# Altium schematic sheet VmeConnectors.SchDoc: VME P1 & P2
size 594 x 420 mm; CheckedBy: CEGELEC BC; CompanyName: CERN; DrawnBy: Andrea Boccardi; Organization: CERN; Address1: European Organization for Nuclear Research; Address2: CH-1211 Genève 23 - Switzerland; Revision: -; SheetNumber: 3; SheetTotal: 11; EDA_Number: EDA-xxxx; Projet: Simple VME FMC Carrier; ModifiedBy: -; CreateDate: 30/03/2010; CheckedDate: 06/04/2010; DivGrp: BE-CO; Designer: Andrea Boccardi; PageSetup: Record=PageOptions|CenterHorizontal=True|CenterVertical=True|PrintScale=0.67|XCorrection=1.00|YCorrection=1.00|PrintKind=1|BorderSize=5000000|LeftOffset=0|BottomOffset=0|Orientation=2|PaperLength=1000|PaperWidth=1000|Scale=100|PaperSource=15|PrintQuality=600|MediaType=1|DitherType=10|PaperKind=A3|PrintScaleMode=1; ModifiedDate: -
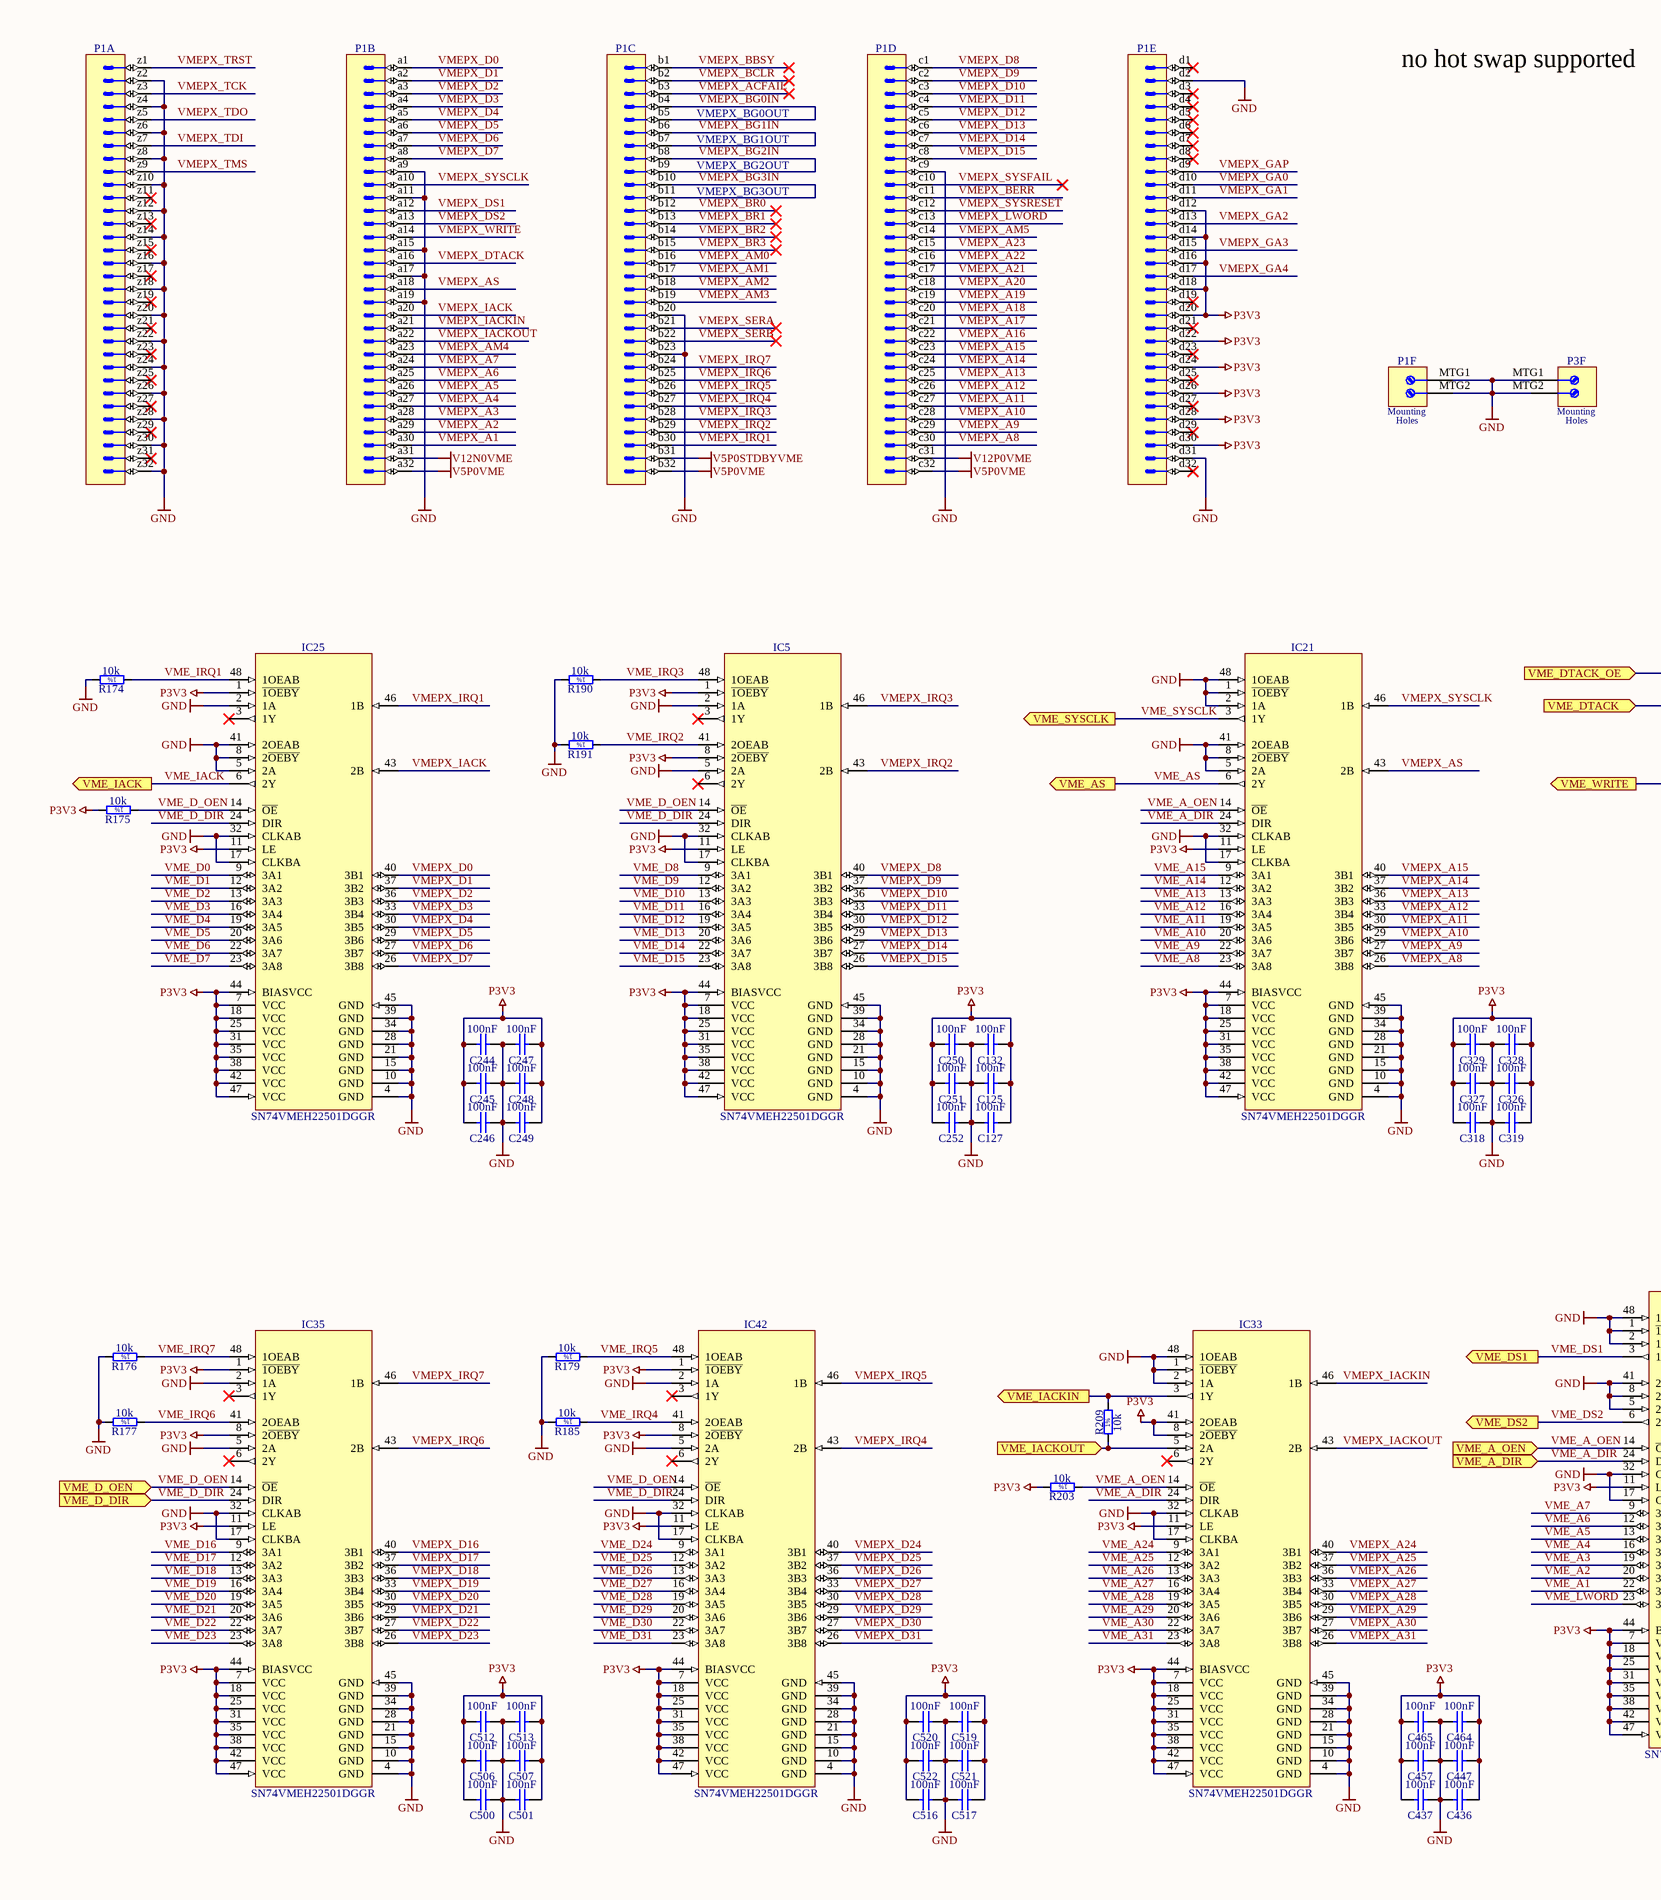
[diagram p0: VmeConnectors.SchDoc, left]
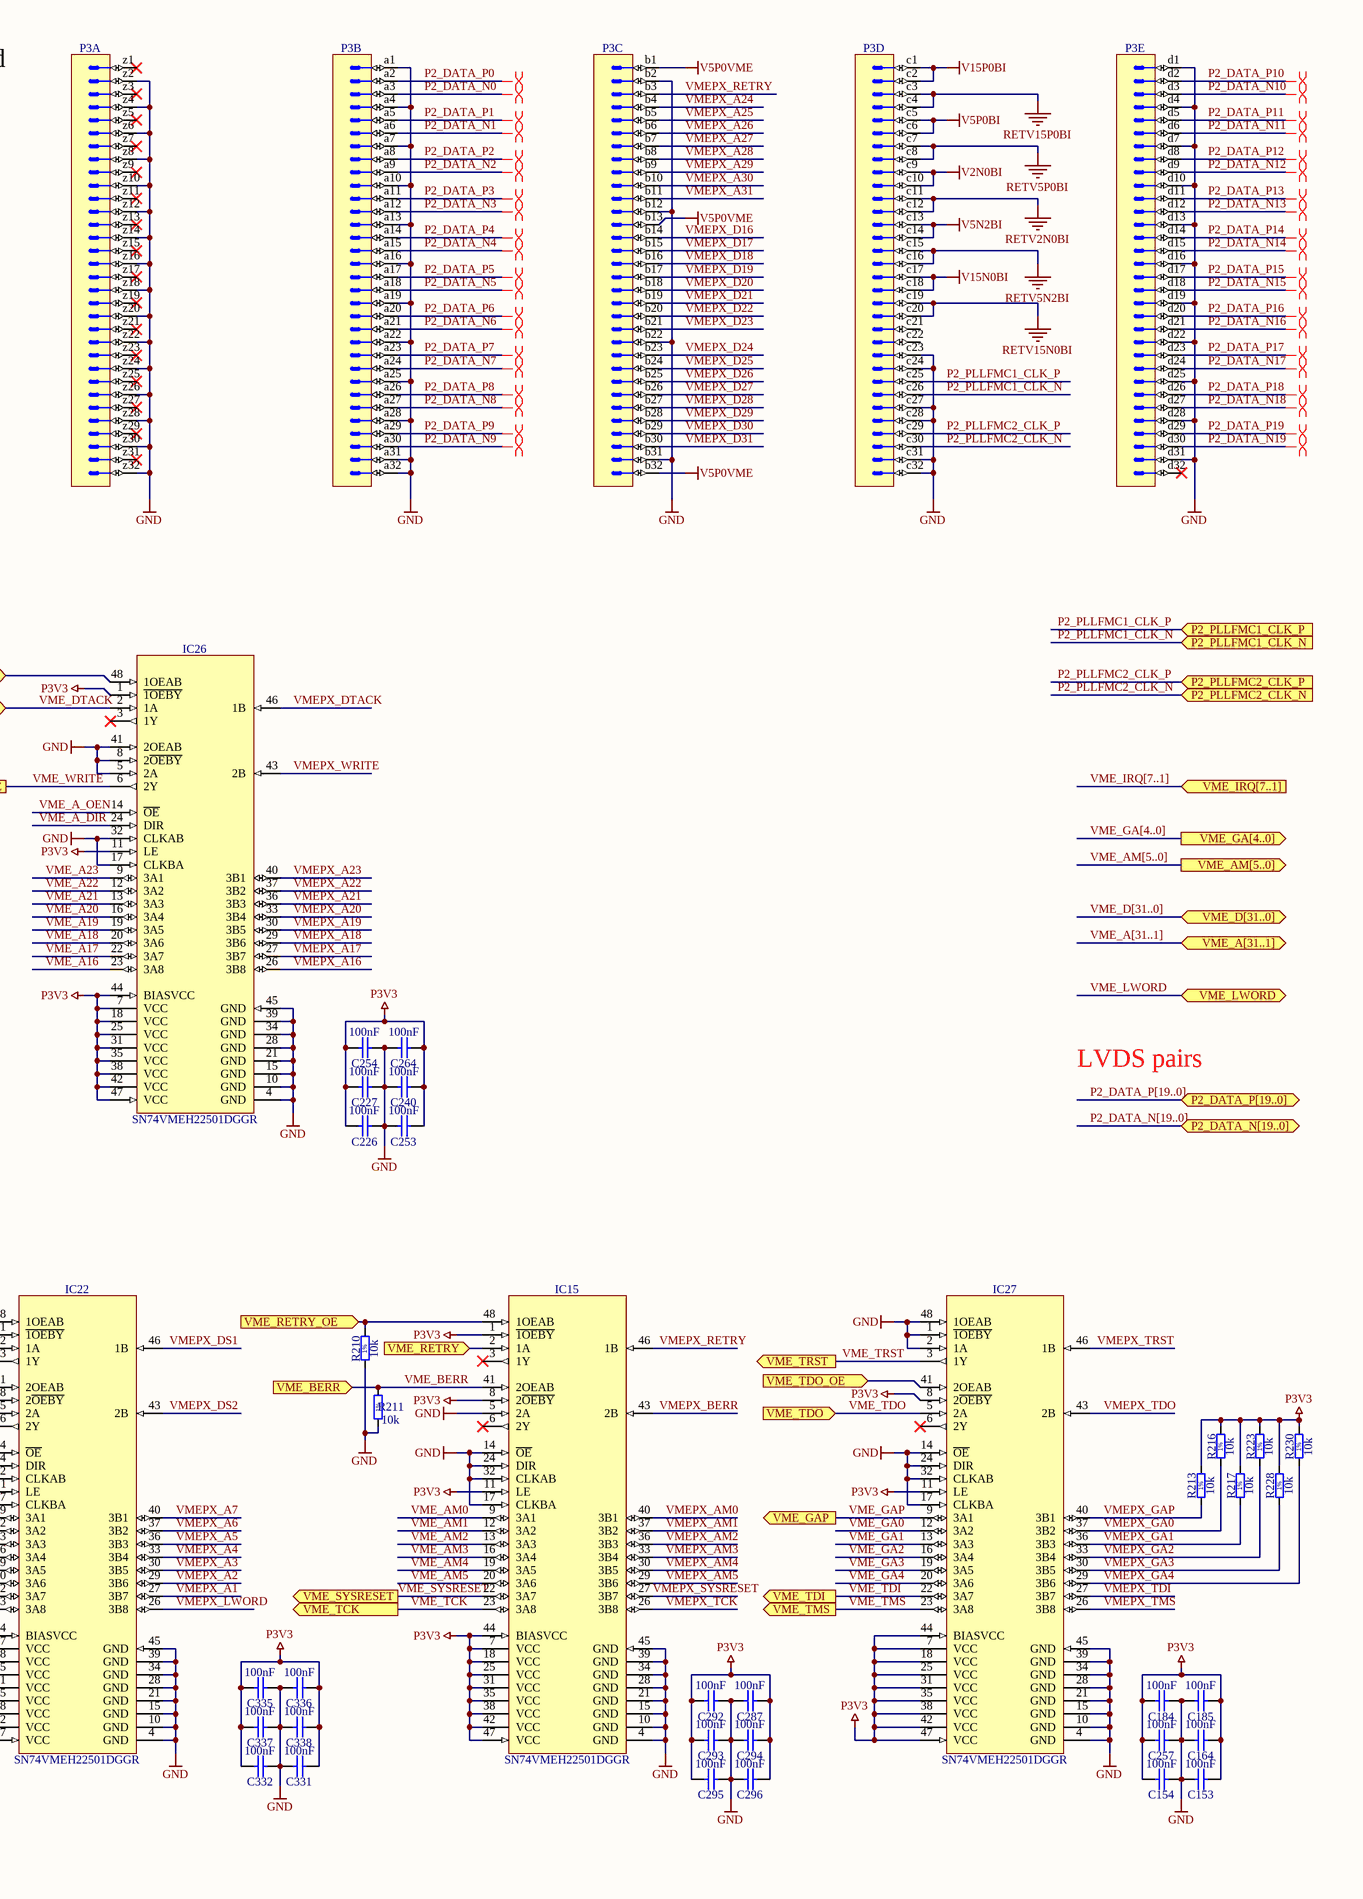
[diagram p1: VmeConnectors.SchDoc, right]

## Parts
C125  100nF  [CAPC1005X55N]
C127  100nF  [CAPC1005X55N]
C132  100nF  [CAPC1005X55N]
C153  100nF  [CAPC1005X55N]
C154  100nF  [CAPC1005X55N]
C164  100nF  [CAPC1005X55N]
C184  100nF  [CAPC1005X55N]
C185  100nF  [CAPC1005X55N]
C226  100nF  [CAPC1005X55N]
C227  100nF  [CAPC1005X55N]
C240  100nF  [CAPC1005X55N]
C244  100nF  [CAPC1005X55N]
C245  100nF  [CAPC1005X55N]
C246  100nF  [CAPC1005X55N]
C247  100nF  [CAPC1005X55N]
C248  100nF  [CAPC1005X55N]
C249  100nF  [CAPC1005X55N]
C250  100nF  [CAPC1005X55N]
C251  100nF  [CAPC1005X55N]
C252  100nF  [CAPC1005X55N]
C253  100nF  [CAPC1005X55N]
C254  100nF  [CAPC1005X55N]
C257  100nF  [CAPC1005X55N]
C264  100nF  [CAPC1005X55N]
C287  100nF  [CAPC1005X55N]
C292  100nF  [CAPC1005X55N]
C293  100nF  [CAPC1005X55N]
C294  100nF  [CAPC1005X55N]
C295  100nF  [CAPC1005X55N]
C296  100nF  [CAPC1005X55N]
C318  100nF  [CAPC1005X55N]
C319  100nF  [CAPC1005X55N]
C326  100nF  [CAPC1005X55N]
C327  100nF  [CAPC1005X55N]
C328  100nF  [CAPC1005X55N]
C329  100nF  [CAPC1005X55N]
C331  100nF  [CAPC1005X55N]
C332  100nF  [CAPC1005X55N]
C335  100nF  [CAPC1005X55N]
C336  100nF  [CAPC1005X55N]
C337  100nF  [CAPC1005X55N]
C338  100nF  [CAPC1005X55N]
C436  100nF  [CAPC1005X55N]
C437  100nF  [CAPC1005X55N]
C447  100nF  [CAPC1005X55N]
C457  100nF  [CAPC1005X55N]
C464  100nF  [CAPC1005X55N]
C465  100nF  [CAPC1005X55N]
C500  100nF  [CAPC1005X55N]
C501  100nF  [CAPC1005X55N]
C506  100nF  [CAPC1005X55N]
C507  100nF  [CAPC1005X55N]
C512  100nF  [CAPC1005X55N]
C513  100nF  [CAPC1005X55N]
C516  100nF  [CAPC1005X55N]
C517  100nF  [CAPC1005X55N]
C519  100nF  [CAPC1005X55N]
C520  100nF  [CAPC1005X55N]
C521  100nF  [CAPC1005X55N]
C522  100nF  [CAPC1005X55N]
IC5  SN74VMEH22501DGGR  [SOP50P810X120-48N]
IC15  SN74VMEH22501DGGR  [SOP50P810X120-48N]
IC21  SN74VMEH22501DGGR  [SOP50P810X120-48N]
IC22  SN74VMEH22501DGGR  [SOP50P810X120-48N]
IC25  SN74VMEH22501DGGR  [SOP50P810X120-48N]
IC26  SN74VMEH22501DGGR  [SOP50P810X120-48N]
IC27  SN74VMEH22501DGGR  [SOP50P810X120-48N]
IC33  SN74VMEH22501DGGR  [SOP50P810X120-48N]
IC35  SN74VMEH22501DGGR  [SOP50P810X120-48N]
IC42  SN74VMEH22501DGGR  [SOP50P810X120-48N]
P1  HAR-BUS 64  [HARTING_02 01 160 2101]  (value not drawn)  (parts A,B,C,D,E,F of 6)
P3  HAR-BUS 64  [HARTING_02 01 160 2101]  (value not drawn)  (parts A,B,C,D,E,F of 6)
R174  10k  [RESC1608X55N]
R175  10k  [RESC1608X55N]
R176  10k  [RESC1608X55N]
R177  10k  [RESC1608X55N]
R179  10k  [RESC1608X55N]
R185  10k  [RESC1608X55N]
R190  10k  [RESC1608X55N]
R191  10k  [RESC1608X55N]
R203  10k  [RESC1608X55N]
R209  10k  [RESC1608X55N]
R210  10k  [RESC1608X55N]
R211  10k  [RESC1608X55N]
R213  10k  [RESC1608X55N]
R216  10k  [RESC1608X55N]
R217  10k  [RESC1608X55N]
R223  10k  [RESC1608X55N]
R228  10k  [RESC1608X55N]
R230  10k  [RESC1608X55N]

## Ports
P2_DATA_N[19..0] (bidir), P2_DATA_P[19..0] (bidir), P2_PLLFMC1_CLK_N (in), P2_PLLFMC1_CLK_P (in), P2_PLLFMC2_CLK_N (in), P2_PLLFMC2_CLK_P (in), VME_A[31..1] (bidir), VME_A_DIR (in), VME_A_OEN (in), VME_AM[5..0] (out), VME_AS (out), VME_BERR (in), VME_D[31..0] (bidir), VME_D_DIR (in), VME_D_OEN (in), VME_DS1 (out), VME_DS2 (out), VME_DTACK (in), VME_DTACK_OE (in), VME_GA[4..0] (out), VME_GAP (out), VME_IACK (out), VME_IACKIN (out), VME_IACKOUT (in), VME_IRQ[7..1] (in), VME_LWORD (bidir), VME_RETRY (in), VME_RETRY_OE (in), VME_SYSCLK (out), VME_SYSRESET (out), VME_TCK (out), VME_TDI (out), VME_TDO (in), VME_TDO_OE (in), VME_TMS (out), VME_TRST (out), VME_WRITE (out)

## Nets
GND: C125.2 C127.2 C132.2 C153.2 C154.1 C164.2 C184.1 C185.2 C226.1 C227.1 C240.2 C244.1 C245.1 C246.1 C247.2 C248.2 C249.2 C250.1 C251.1 C252.1 C253.2 C254.1 C257.1 C264.2 C287.2 C292.1 C293.1 C294.2 C295.1 C296.2 C318.1 C319.2 C326.2 C327.1 C328.2 C329.1 C331.2 C332.1 C335.1 C336.2 C337.1 C338.2 C436.2 C437.1 C447.2 C457.1 C464.2 C465.1 C500.1 C501.2 C506.1 C507.2 C512.1 C513.2 C516.1 C517.2 C519.2 C520.1 C521.2 C522.1 IC5.2(1A) IC5.4(GND) IC5.5(2A) IC5.10(GND) IC5.15(GND) IC5.17(CLKBA) IC5.21(GND) IC5.28(GND) IC5.32(CLKAB) IC5.34(GND) IC5.39(GND) IC5.45(GND) IC15.4(GND) IC15.5(2A) IC15.10(GND) IC15.14(~{OE}) IC15.15(GND) IC15.17(CLKBA) IC15.21(GND) IC15.24(DIR) IC15.28(GND) IC15.32(CLKAB) IC15.34(GND) IC15.39(GND) IC15.45(GND) IC21.1(~{1OEBY}) IC21.2(1A) IC21.4(GND) IC21.5(2A) IC21.8(2~{OEBY}) IC21.10(GND) IC21.15(GND) IC21.17(CLKBA) IC21.21(GND) IC21.28(GND) IC21.32(CLKAB) IC21.34(GND) IC21.39(GND) IC21.41(2OEAB) IC21.45(GND) IC21.48(1OEAB) IC22.1(~{1OEBY}) IC22.2(1A) IC22.4(GND) IC22.5(2A) IC22.8(2~{OEBY}) IC22.10(GND) IC22.15(GND) IC22.17(CLKBA) IC22.21(GND) IC22.28(GND) IC22.32(CLKAB) IC22.34(GND) IC22.39(GND) IC22.41(2OEAB) IC22.45(GND) IC22.48(1OEAB) IC25.2(1A) IC25.4(GND) IC25.5(2A) IC25.8(2~{OEBY}) IC25.10(GND) IC25.15(GND) IC25.17(CLKBA) IC25.21(GND) IC25.28(GND) IC25.32(CLKAB) IC25.34(GND) IC25.39(GND) IC25.41(2OEAB) IC25.45(GND) IC26.4(GND) IC26.5(2A) IC26.8(2~{OEBY}) IC26.10(GND) IC26.15(GND) IC26.17(CLKBA) IC26.21(GND) IC26.28(GND) IC26.32(CLKAB) IC26.34(GND) IC26.39(GND) IC26.41(2OEAB) IC26.45(GND) IC27.1(~{1OEBY}) IC27.2(1A) IC27.4(GND) IC27.10(GND) IC27.14(~{OE}) IC27.15(GND) IC27.17(CLKBA) IC27.21(GND) IC27.24(DIR) IC27.28(GND) IC27.32(CLKAB) IC27.34(GND) IC27.39(GND) IC27.45(GND) IC27.48(1OEAB) IC33.1(~{1OEBY}) IC33.2(1A) IC33.4(GND) IC33.10(GND) IC33.15(GND) IC33.17(CLKBA) IC33.21(GND) IC33.28(GND) IC33.32(CLKAB) IC33.34(GND) IC33.39(GND) IC33.45(GND) IC33.48(1OEAB) IC35.2(1A) IC35.4(GND) IC35.5(2A) IC35.10(GND) IC35.15(GND) IC35.17(CLKBA) IC35.21(GND) IC35.28(GND) IC35.32(CLKAB) IC35.34(GND) IC35.39(GND) IC35.45(GND) IC42.2(1A) IC42.4(GND) IC42.5(2A) IC42.10(GND) IC42.15(GND) IC42.17(CLKBA) IC42.21(GND) IC42.28(GND) IC42.32(CLKAB) IC42.34(GND) IC42.39(GND) IC42.45(GND) P1.a9 P1.a11 P1.a15 P1.a17 P1.a19 P1.b20 P1.b23 P1.c9 P1.d2 P1.d31 P1.MTG1 P1.MTG2 P1.z2 P1.z4 P1.z6 P1.z8 P1.z10 P1.z12 P1.z14 P1.z16 P1.z18 P1.z20 P1.z22 P1.z24 P1.z26 P1.z28 P1.z30 P1.z32 P3.a1 P3.a4 P3.a7 P3.a10 P3.a13 P3.a16 P3.a19 P3.a22 P3.a25 P3.a28 P3.a31 P3.a32 P3.b2 P3.b12 P3.b22 P3.b31 P3.c23 P3.c24 P3.c27 P3.c28 P3.c31 P3.c32 P3.d1 P3.d4 P3.d7 P3.d10 P3.d13 P3.d16 P3.d19 P3.d22 P3.d25 P3.d28 P3.d31 P3.MTG1 P3.MTG2 P3.z2 P3.z4 P3.z6 P3.z8 P3.z10 P3.z12 P3.z14 P3.z16 P3.z18 P3.z20 P3.z22 P3.z24 P3.z26 P3.z28 P3.z30 P3.z32 R174.2 R176.2 R177.2 R179.2 R185.2 R190.2 R191.2 R210.1 R211.1
P3V3: C125.1 C127.1 C132.1 C153.1 C154.2 C164.1 C184.2 C185.1 C226.2 C227.2 C240.1 C244.2 C245.2 C246.2 C247.1 C248.1 C249.1 C250.2 C251.2 C252.2 C253.1 C254.2 C257.2 C264.1 C287.1 C292.2 C293.2 C294.1 C295.2 C296.1 C318.2 C319.1 C326.1 C327.2 C328.1 C329.2 C331.1 C332.2 C335.2 C336.1 C337.2 C338.1 C436.1 C437.2 C447.1 C457.2 C464.1 C465.2 C500.2 C501.1 C506.2 C507.1 C512.2 C513.1 C516.2 C517.1 C519.1 C520.2 C521.1 C522.2 IC5.1(~{1OEBY}) IC5.7(VCC) IC5.8(2~{OEBY}) IC5.11(LE) IC5.18(VCC) IC5.25(VCC) IC5.31(VCC) IC5.35(VCC) IC5.38(VCC) IC5.42(VCC) IC5.44(BIASVCC) IC5.47(VCC) IC15.1(~{1OEBY}) IC15.7(VCC) IC15.8(2~{OEBY}) IC15.11(LE) IC15.18(VCC) IC15.25(VCC) IC15.31(VCC) IC15.35(VCC) IC15.38(VCC) IC15.42(VCC) IC15.44(BIASVCC) IC15.47(VCC) IC21.7(VCC) IC21.11(LE) IC21.18(VCC) IC21.25(VCC) IC21.31(VCC) IC21.35(VCC) IC21.38(VCC) IC21.42(VCC) IC21.44(BIASVCC) IC21.47(VCC) IC22.7(VCC) IC22.11(LE) IC22.18(VCC) IC22.25(VCC) IC22.31(VCC) IC22.35(VCC) IC22.38(VCC) IC22.42(VCC) IC22.44(BIASVCC) IC22.47(VCC) IC25.1(~{1OEBY}) IC25.7(VCC) IC25.11(LE) IC25.18(VCC) IC25.25(VCC) IC25.31(VCC) IC25.35(VCC) IC25.38(VCC) IC25.42(VCC) IC25.44(BIASVCC) IC25.47(VCC) IC26.1(~{1OEBY}) IC26.7(VCC) IC26.11(LE) IC26.18(VCC) IC26.25(VCC) IC26.31(VCC) IC26.35(VCC) IC26.38(VCC) IC26.42(VCC) IC26.44(BIASVCC) IC26.47(VCC) IC27.7(VCC) IC27.8(2~{OEBY}) IC27.11(LE) IC27.18(VCC) IC27.25(VCC) IC27.31(VCC) IC27.35(VCC) IC27.38(VCC) IC27.42(VCC) IC27.44(BIASVCC) IC27.47(VCC) IC33.7(VCC) IC33.8(2~{OEBY}) IC33.11(LE) IC33.18(VCC) IC33.25(VCC) IC33.31(VCC) IC33.35(VCC) IC33.38(VCC) IC33.41(2OEAB) IC33.42(VCC) IC33.44(BIASVCC) IC33.47(VCC) IC35.1(~{1OEBY}) IC35.7(VCC) IC35.8(2~{OEBY}) IC35.11(LE) IC35.18(VCC) IC35.25(VCC) IC35.31(VCC) IC35.35(VCC) IC35.38(VCC) IC35.42(VCC) IC35.44(BIASVCC) IC35.47(VCC) IC42.1(~{1OEBY}) IC42.7(VCC) IC42.8(2~{OEBY}) IC42.11(LE) IC42.18(VCC) IC42.25(VCC) IC42.31(VCC) IC42.35(VCC) IC42.38(VCC) IC42.42(VCC) IC42.44(BIASVCC) IC42.47(VCC) P1.d12 P1.d14 P1.d16 P1.d18 P1.d20 P1.d22 P1.d24 P1.d26 P1.d28 P1.d30 R175.2 R203.2 R213.2 R216.2 R217.2 R223.2 R228.2 R230.2
RETV2N0BI: P3.c11 P3.c12
RETV5N2BI: P3.c15 P3.c16
RETV5P0BI: P3.c7 P3.c8
RETV15N0BI: P3.c19 P3.c20
RETV15P0BI: P3.c3 P3.c4
V2N0BI: P3.c9 P3.c10
V5N2BI: P3.c13 P3.c14
V5P0BI: P3.c5 P3.c6
V5P0STDBYVME: P1.b31
V5P0VME: P1.a32 P1.b32 P1.c32 P3.b1 P3.b13 P3.b32
V12N0VME: P1.a31
V12P0VME: P1.c31
V15N0BI: P3.c17 P3.c18
V15P0BI: P3.c1 P3.c2
P2_DATA_N0: P3.a3
P2_DATA_N1: P3.a6
P2_DATA_N2: P3.a9
P2_DATA_N3: P3.a12
P2_DATA_N4: P3.a15
P2_DATA_N5: P3.a18
P2_DATA_N6: P3.a21
P2_DATA_N7: P3.a24
P2_DATA_N8: P3.a27
P2_DATA_N9: P3.a30
P2_DATA_N10: P3.d3
P2_DATA_N11: P3.d6
P2_DATA_N12: P3.d9
P2_DATA_N13: P3.d12
P2_DATA_N14: P3.d15
P2_DATA_N15: P3.d18
P2_DATA_N16: P3.d21
P2_DATA_N17: P3.d24
P2_DATA_N18: P3.d27
P2_DATA_N19: P3.d30
P2_DATA_P0: P3.a2
P2_DATA_P1: P3.a5
P2_DATA_P2: P3.a8
P2_DATA_P3: P3.a11
P2_DATA_P4: P3.a14
P2_DATA_P5: P3.a17
P2_DATA_P6: P3.a20
P2_DATA_P7: P3.a23
P2_DATA_P8: P3.a26
P2_DATA_P9: P3.a29
P2_DATA_P10: P3.d2
P2_DATA_P11: P3.d5
P2_DATA_P12: P3.d8
P2_DATA_P13: P3.d11
P2_DATA_P14: P3.d14
P2_DATA_P15: P3.d17
P2_DATA_P16: P3.d20
P2_DATA_P17: P3.d23
P2_DATA_P18: P3.d26
P2_DATA_P19: P3.d29
P2_PLLFMC1_CLK_N: P3.c26 ; port P2_PLLFMC1_CLK_N
P2_PLLFMC1_CLK_P: P3.c25 ; port P2_PLLFMC1_CLK_P
P2_PLLFMC2_CLK_N: P3.c30 ; port P2_PLLFMC2_CLK_N
P2_PLLFMC2_CLK_P: P3.c29 ; port P2_PLLFMC2_CLK_P
VME_A1: IC22.22(3A7)
VME_A2: IC22.20(3A6)
VME_A3: IC22.19(3A5)
VME_A4: IC22.16(3A4)
VME_A5: IC22.13(3A3)
VME_A6: IC22.12(3A2)
VME_A7: IC22.9(3A1)
VME_A8: IC21.23(3A8)
VME_A9: IC21.22(3A7)
VME_A10: IC21.20(3A6)
VME_A11: IC21.19(3A5)
VME_A12: IC21.16(3A4)
VME_A13: IC21.13(3A3)
VME_A14: IC21.12(3A2)
VME_A15: IC21.9(3A1)
VME_A16: IC26.23(3A8)
VME_A17: IC26.22(3A7)
VME_A18: IC26.20(3A6)
VME_A19: IC26.19(3A5)
VME_A20: IC26.16(3A4)
VME_A21: IC26.13(3A3)
VME_A22: IC26.12(3A2)
VME_A23: IC26.9(3A1)
VME_A24: IC33.9(3A1)
VME_A25: IC33.12(3A2)
VME_A26: IC33.13(3A3)
VME_A27: IC33.16(3A4)
VME_A28: IC33.19(3A5)
VME_A29: IC33.20(3A6)
VME_A30: IC33.22(3A7)
VME_A31: IC33.23(3A8)
VME_A_DIR: IC21.24(DIR) IC22.24(DIR) IC26.24(DIR) IC33.24(DIR) ; port VME_A_DIR
VME_A_OEN: IC21.14(~{OE}) IC22.14(~{OE}) IC26.14(~{OE}) IC33.14(~{OE}) R203.1 ; port VME_A_OEN
VME_AM0: IC15.9(3A1)
VME_AM1: IC15.12(3A2)
VME_AM2: IC15.13(3A3)
VME_AM3: IC15.16(3A4)
VME_AM4: IC15.19(3A5)
VME_AM5: IC15.20(3A6)
VME_AS: IC21.6(2Y) ; port VME_AS
VME_BERR: IC15.41(2OEAB) R211.2 ; port VME_BERR
VME_D0: IC25.9(3A1)
VME_D1: IC25.12(3A2)
VME_D2: IC25.13(3A3)
VME_D3: IC25.16(3A4)
VME_D4: IC25.19(3A5)
VME_D5: IC25.20(3A6)
VME_D6: IC25.22(3A7)
VME_D7: IC25.23(3A8)
VME_D8: IC5.9(3A1)
VME_D9: IC5.12(3A2)
VME_D10: IC5.13(3A3)
VME_D11: IC5.16(3A4)
VME_D12: IC5.19(3A5)
VME_D13: IC5.20(3A6)
VME_D14: IC5.22(3A7)
VME_D15: IC5.23(3A8)
VME_D16: IC35.9(3A1)
VME_D17: IC35.12(3A2)
VME_D18: IC35.13(3A3)
VME_D19: IC35.16(3A4)
VME_D20: IC35.19(3A5)
VME_D21: IC35.20(3A6)
VME_D22: IC35.22(3A7)
VME_D23: IC35.23(3A8)
VME_D24: IC42.9(3A1)
VME_D25: IC42.12(3A2)
VME_D26: IC42.13(3A3)
VME_D27: IC42.16(3A4)
VME_D28: IC42.19(3A5)
VME_D29: IC42.20(3A6)
VME_D30: IC42.22(3A7)
VME_D31: IC42.23(3A8)
VME_D_DIR: IC5.24(DIR) IC25.24(DIR) IC35.24(DIR) IC42.24(DIR) ; port VME_D_DIR
VME_D_OEN: IC5.14(~{OE}) IC25.14(~{OE}) IC35.14(~{OE}) IC42.14(~{OE}) R175.1 ; port VME_D_OEN
VME_DS1: IC22.3(1Y) ; port VME_DS1
VME_DS2: IC22.6(2Y) ; port VME_DS2
VME_DTACK: IC26.2(1A) ; port VME_DTACK
VME_DTACK_OE: IC26.48(1OEAB) ; port VME_DTACK_OE
VME_GA0: IC27.12(3A2)
VME_GA1: IC27.13(3A3)
VME_GA2: IC27.16(3A4)
VME_GA3: IC27.19(3A5)
VME_GA4: IC27.20(3A6)
VME_GAP: IC27.9(3A1) ; port VME_GAP
VME_IACK: IC25.6(2Y) ; port VME_IACK
VME_IACKIN: IC33.3(1Y) R209.2 ; port VME_IACKIN
VME_IACKOUT: IC33.5(2A) R209.1 ; port VME_IACKOUT
VME_IRQ1: IC25.48(1OEAB) R174.1
VME_IRQ2: IC5.41(2OEAB) R191.1
VME_IRQ3: IC5.48(1OEAB) R190.1
VME_IRQ4: IC42.41(2OEAB) R185.1
VME_IRQ5: IC42.48(1OEAB) R179.1
VME_IRQ6: IC35.41(2OEAB) R177.1
VME_IRQ7: IC35.48(1OEAB) R176.1
VME_LWORD: IC22.23(3A8) ; port VME_LWORD
VME_RETRY: IC15.2(1A) ; port VME_RETRY
VME_RETRY_OE: IC15.48(1OEAB) R210.2 ; port VME_RETRY_OE
VME_SYSCLK: IC21.3(1Y) ; port VME_SYSCLK
VME_SYSRESET: IC15.22(3A7) ; port VME_SYSRESET
VME_TCK: IC15.23(3A8) ; port VME_TCK
VME_TDI: IC27.22(3A7) ; port VME_TDI
VME_TDO: IC27.5(2A) ; port VME_TDO
VME_TDO_OE: IC27.41(2OEAB) ; port VME_TDO_OE
VME_TMS: IC27.23(3A8) ; port VME_TMS
VME_TRST: IC27.3(1Y) ; port VME_TRST
VME_WRITE: IC26.6(2Y) ; port VME_WRITE
VMEPX_A1: IC22.27(3B7) P1.a30
VMEPX_A2: IC22.29(3B6) P1.a29
VMEPX_A3: IC22.30(3B5) P1.a28
VMEPX_A4: IC22.33(3B4) P1.a27
VMEPX_A5: IC22.36(3B3) P1.a26
VMEPX_A6: IC22.37(3B2) P1.a25
VMEPX_A7: IC22.40(3B1) P1.a24
VMEPX_A8: IC21.26(3B8) P1.c30
VMEPX_A9: IC21.27(3B7) P1.c29
VMEPX_A10: IC21.29(3B6) P1.c28
VMEPX_A11: IC21.30(3B5) P1.c27
VMEPX_A12: IC21.33(3B4) P1.c26
VMEPX_A13: IC21.36(3B3) P1.c25
VMEPX_A14: IC21.37(3B2) P1.c24
VMEPX_A15: IC21.40(3B1) P1.c23
VMEPX_A16: IC26.26(3B8) P1.c22
VMEPX_A17: IC26.27(3B7) P1.c21
VMEPX_A18: IC26.29(3B6) P1.c20
VMEPX_A19: IC26.30(3B5) P1.c19
VMEPX_A20: IC26.33(3B4) P1.c18
VMEPX_A21: IC26.36(3B3) P1.c17
VMEPX_A22: IC26.37(3B2) P1.c16
VMEPX_A23: IC26.40(3B1) P1.c15
VMEPX_A24: IC33.40(3B1) P3.b4
VMEPX_A25: IC33.37(3B2) P3.b5
VMEPX_A26: IC33.36(3B3) P3.b6
VMEPX_A27: IC33.33(3B4) P3.b7
VMEPX_A28: IC33.30(3B5) P3.b8
VMEPX_A29: IC33.29(3B6) P3.b9
VMEPX_A30: IC33.27(3B7) P3.b10
VMEPX_A31: IC33.26(3B8) P3.b11
VMEPX_ACFAIL: P1.b3
VMEPX_AM0: IC15.40(3B1) P1.b16
VMEPX_AM1: IC15.37(3B2) P1.b17
VMEPX_AM2: IC15.36(3B3) P1.b18
VMEPX_AM3: IC15.33(3B4) P1.b19
VMEPX_AM4: IC15.30(3B5) P1.a23
VMEPX_AM5: IC15.29(3B6) P1.c14
VMEPX_AS: IC21.43(2B) P1.a18
VMEPX_BBSY: P1.b1
VMEPX_BCLR: P1.b2
VMEPX_BERR: IC15.43(2B) P1.c11
VMEPX_BG0IN: P1.b4 P1.b5
VMEPX_BG1IN: P1.b6 P1.b7
VMEPX_BG2IN: P1.b8 P1.b9
VMEPX_BG3IN: P1.b10 P1.b11
VMEPX_BR0: P1.b12
VMEPX_BR1: P1.b13
VMEPX_BR2: P1.b14
VMEPX_BR3: P1.b15
VMEPX_D0: IC25.40(3B1) P1.a1
VMEPX_D1: IC25.37(3B2) P1.a2
VMEPX_D2: IC25.36(3B3) P1.a3
VMEPX_D3: IC25.33(3B4) P1.a4
VMEPX_D4: IC25.30(3B5) P1.a5
VMEPX_D5: IC25.29(3B6) P1.a6
VMEPX_D6: IC25.27(3B7) P1.a7
VMEPX_D7: IC25.26(3B8) P1.a8
VMEPX_D8: IC5.40(3B1) P1.c1
VMEPX_D9: IC5.37(3B2) P1.c2
VMEPX_D10: IC5.36(3B3) P1.c3
VMEPX_D11: IC5.33(3B4) P1.c4
VMEPX_D12: IC5.30(3B5) P1.c5
VMEPX_D13: IC5.29(3B6) P1.c6
VMEPX_D14: IC5.27(3B7) P1.c7
VMEPX_D15: IC5.26(3B8) P1.c8
VMEPX_D16: IC35.40(3B1) P3.b14
VMEPX_D17: IC35.37(3B2) P3.b15
VMEPX_D18: IC35.36(3B3) P3.b16
VMEPX_D19: IC35.33(3B4) P3.b17
VMEPX_D20: IC35.30(3B5) P3.b18
VMEPX_D21: IC35.29(3B6) P3.b19
VMEPX_D22: IC35.27(3B7) P3.b20
VMEPX_D23: IC35.26(3B8) P3.b21
VMEPX_D24: IC42.40(3B1) P3.b23
VMEPX_D25: IC42.37(3B2) P3.b24
VMEPX_D26: IC42.36(3B3) P3.b25
VMEPX_D27: IC42.33(3B4) P3.b26
VMEPX_D28: IC42.30(3B5) P3.b27
VMEPX_D29: IC42.29(3B6) P3.b28
VMEPX_D30: IC42.27(3B7) P3.b29
VMEPX_D31: IC42.26(3B8) P3.b30
VMEPX_DS1: IC22.46(1B) P1.a12
VMEPX_DS2: IC22.43(2B) P1.a13
VMEPX_DTACK: IC26.46(1B) P1.a16
VMEPX_GA0: IC27.37(3B2) P1.d10 R216.1
VMEPX_GA1: IC27.36(3B3) P1.d11 R217.1
VMEPX_GA2: IC27.33(3B4) P1.d13 R223.1
VMEPX_GA3: IC27.30(3B5) P1.d15 R228.1
VMEPX_GA4: IC27.29(3B6) P1.d17 R230.1
VMEPX_GAP: IC27.40(3B1) P1.d9 R213.1
VMEPX_IACK: IC25.43(2B) P1.a20
VMEPX_IACKIN: IC33.46(1B) P1.a21
VMEPX_IACKOUT: IC33.43(2B) P1.a22
VMEPX_IRQ1: IC25.46(1B) P1.b30
VMEPX_IRQ2: IC5.43(2B) P1.b29
VMEPX_IRQ3: IC5.46(1B) P1.b28
VMEPX_IRQ4: IC42.43(2B) P1.b27
VMEPX_IRQ5: IC42.46(1B) P1.b26
VMEPX_IRQ6: IC35.43(2B) P1.b25
VMEPX_IRQ7: IC35.46(1B) P1.b24
VMEPX_LWORD: IC22.26(3B8) P1.c13
VMEPX_RETRY: IC15.46(1B) P3.b3
VMEPX_SERA: P1.b21
VMEPX_SERB: P1.b22
VMEPX_SYSCLK: IC21.46(1B) P1.a10
VMEPX_SYSFAIL: P1.c10
VMEPX_SYSRESET: IC15.27(3B7) P1.c12
VMEPX_TCK: IC15.26(3B8) P1.z3
VMEPX_TDI: IC27.27(3B7) P1.z7
VMEPX_TDO: IC27.43(2B) P1.z5
VMEPX_TMS: IC27.26(3B8) P1.z9
VMEPX_TRST: IC27.46(1B) P1.z1
VMEPX_WRITE: IC26.43(2B) P1.a14

Not connected (* = marked no-connect by the designer): IC5 3(1Y)* 6(2Y)*; IC15 3(1Y)* 6(2Y)*; IC25 3(1Y)*; IC26 3(1Y)*; IC27 6(2Y)*; IC33 6(2Y)*; IC35 3(1Y)* 6(2Y)*; IC42 3(1Y)* 6(2Y)*; P1 d1* d3* d4* d5* d6* d7* d8* d19* d21* d23* d25* d27* d29* d32* z11* z13* z15* z17* z19* z21* z23* z25* z27* z29* z31*; P3 c21 c22 d32* z1* z3* z5* z7* z9* z11* z13* z15* z17* z19* z21* z23* z25* z27* z29* z31*

## Buses and harness runs
bus P2_DATA_N[19..0] = port P2_DATA_N[19..0]
bus P2_DATA_P[19..0] = port P2_DATA_P[19..0]
bus VME_A[31..1] = port VME_A[31..1]
bus VME_AM[5..0] = port VME_AM[5..0]
bus VME_D[31..0] = port VME_D[31..0]
bus VME_GA[4..0] = port VME_GA[4..0]
bus VME_IRQ[7..1] = port VME_IRQ[7..1]

## Layout directives
differential pair: P2_DATA_N0, P2_DATA_N1, P2_DATA_N2, P2_DATA_N3, P2_DATA_N4, P2_DATA_N5, P2_DATA_N6, P2_DATA_N7, P2_DATA_N8, P2_DATA_N9, P2_DATA_N10, P2_DATA_N11, P2_DATA_N12, P2_DATA_N13, P2_DATA_N14, P2_DATA_N15, P2_DATA_N16, P2_DATA_N17, P2_DATA_N18, P2_DATA_N19, P2_DATA_P0, P2_DATA_P1, P2_DATA_P2, P2_DATA_P3, P2_DATA_P4, P2_DATA_P5, P2_DATA_P6, P2_DATA_P7, P2_DATA_P8, P2_DATA_P9, P2_DATA_P10, P2_DATA_P11, P2_DATA_P12, P2_DATA_P13, P2_DATA_P14, P2_DATA_P15, P2_DATA_P16, P2_DATA_P17, P2_DATA_P18, P2_DATA_P19

## Notes on the sheet
- VMEPX_BG0OUT
- no hot swap supported
- VMEPX_BG1OUT
- VMEPX_BG2OUT
- VMEPX_BG3OUT
- LVDS pairs
- Project/Equipment
- Document
- File
- Designer
- Drawn by
- Check.by
- Last Mod.
- Print Date
- Sheet
- Size
- A2
- of
- Rev
- (in symbol HARTING_02 01 160 2101, part F) Mounting; Holes
- (in symbol R0603_10K_1%_0.1W_100PPM) 1%

## Library data of the parts
C125 C127 C132 C153 C154 C164 C184 C185 C226 C227 C240 C244-C254 C257 C264 C287 C292-C296 C318 C319 C326-C329 C331 C332 C335-C338 C436 C437 C447 C457 C464 C465 C500 C501 C506 C507 C512 C513 C516 C517 C519-C522 = CC0402_100NF_16V_10%_X7R: Non-polarised capacitor; Part Description: SMD Multilayer Chip Ceramic Capacitor; Manufacturer: GENERIC; Manufacturer1 Part Number: 223878715649; Voltage: 16V; TC: X7R; Tolerance: ±10%; Table: Capacitors SMD; Part Number: CC0402_100NF_16V_10%_X7R; Component Kind: Standard; Component Type: Standard; Pin Count: 2; Value: 100nF; Status: Not Recommended; Manufacturer Part Number: CC0402_100NF_16V_10%_X7R; Case: 0402; Mounted: Yes; Socket: No; SMD: Yes; Manufacturer1 Example: PHYCOMP; Manufacturer1 ComponentHeight: 0.55mm; HelpURL: \\cern.ch\dfs\Applications\Altium\Datasheets\CC0402_X7R_PHYCOMP.pdf; Author: CERN DEM JLC; CreateDate: 12/3/2007; LatestRevisionDate: 12/3/2007
IC5 IC15 IC21 IC22 IC25-IC27 IC33 IC35 IC42 = SN74VMEH22501DGGR: 8-Bit Universal Bus Transceiver and Two 1-Bit Bus Transceivers with 3-State Outputs; Manufacturer: TEXAS INSTRUMENTS; Table: Standard Logic; Part Number: SN74VMEH22501DGGR; Component Kind: Standard; Component Type: Standard; Device: SN74VMEH22501DGGR; PackageDescription: SOP, 48-Leads, Body 12.6x6.2mm (max), Pitch 0.50mm, IPC Medium Density; Part Description: 8-Bit Universal Bus Transceiver and Two 1-Bit Bus Transceivers with 3-State Outputs; Manufacturer Part Number: SN74VMEH22501DGGR; Pin Count: 48; Case: TSSOP48; Mounted: Yes; Socket: No; SMD: Yes; ComponentHeight: 1.2mm; Author: CERN DEM JLC; HelpURL: \\cern.ch\dfs\Applications\Altium\Datasheets\SN74VMEH22501DGGR.pdf; CreateDate: 10/27/2009; LatestRevisionDate: 10/27/2009
P1 P3 = HARTING_02 01 160 2101: Connector 160zabcd Male (5x32); Part Description: DIN 41612, har-bus 64, 160 poles,5 Rows z+a+b+c+d, Angled solder pins, Male contacts, Pitch 2.54mm; Part Number: HARTING_02 01 160 2101; Component Kind: Standard; Component Type: Standard; Pin Count: 162; Family: HAR-BUS 64; Mounted: Yes; Socket: No; SMD: No; Manufacturer: HARTING; Manufacturer Part Number: 02 01 160 2101; ComponentHeight: 11.1mm; HelpURL: \\cern.ch\dfs\Applications\Altium\Datasheets\HARTING_02 01 160 2101.pdf; Author: CERN DEM JLC; CreateDate: 26/11/2008; LatestRevisionDate: 26/11/2008; Table: HARTING
R174-R177 R179 R185 R190 R191 R203 R209-R211 R213 R216 R217 R223 R228 R230 = R0603_10K_1%_0.1W_100PPM: Resistor - 1%; Part Description: General Purpose Thick Film Chip Resistor; Manufacturer: GENERIC; Manufacturer1 Part Number: NRC06F1002TRF; Power: 0.1W; TC: ±100ppm/°C; Table: Resistors SMD; Part Number: R0603_10K_1%_0.1W_100PPM; Component Kind: Standard; Component Type: Standard; Pin Count: 2; Value: 10k; Status: Preferred; Tolerance: ±1%; Manufacturer Part Number: R0603_10K_1%_0.1W_100PPM; Case: 0603; Mounted: Yes; Socket: No; SMD: Yes; Manufacturer1 Example: NIC COMPONENT; Manufacturer1 ComponentHeight: 0.55mm; HelpURL: \\cern.ch\dfs\Applications\Altium\Datasheets\R0603_NIC_NRC.pdf; Author: CERN DEM JLC; CreateDate: 2007-12-03; LatestRevisionDate: 2008-03-13